# Altium project SGM452 Temperature Sensor.PrjPcb
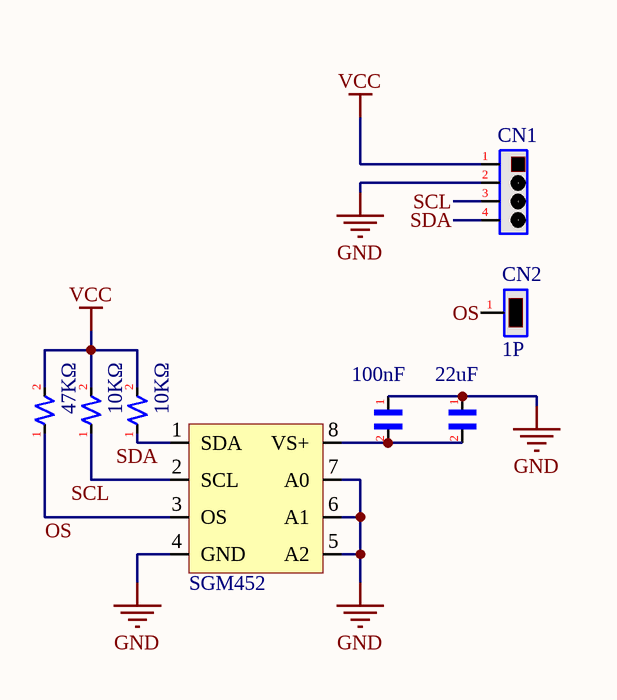
[diagram p0: Design.SchDoc]
1 sheet, 8 parts. Net scope: global (net labels, ports and power ports of the same name join across sheets).
Board file: PCB1.PcbDoc

## Sheet Design.SchDoc
size A; SheetNumber: 1; SheetTotal: 1

### Parts
C1  100nF  [C_0603]
C2  22uF  [C_0603]
CN1  (no value)  [CN_4P_A2001WV-XP-180DEG]
CN2  1P  [CN_Ø1.25mm_Lead]
R1  47KΩ  [R_0603]
R2  10KΩ  [R_0603]
R3  10KΩ  [R_0603]
SGM1  SGM452  [SGM452-TSOP65P490X110-8N]

### Nets
GND: C1.1 C2.1 CN1.2 SGM1.4(GND) SGM1.5(A2) SGM1.6(A1) SGM1.7(A0)
VCC: CN1.1 R1.2 R2.2 R3.2
OS: CN2.1 R1.1 SGM1.3(OS)
SCL: CN1.3 R2.1 SGM1.2(SCL)
SDA: CN1.4 R3.1 SGM1.1(SDA)
NetC1_2: C1.2 C2.2 SGM1.8(VS+)

### Library data of the parts
C1 C2 = Capacitor>> Non-Polar
CN1 = Connector>> 4Pins
CN2 = Connector>> 1Pin
R1-R3 = Resistor>> General Purpose
SGM1 = SGM452: SGM452 / Digital Temperature Sensor and / Thermal Watchdog with Two-Wire Interface